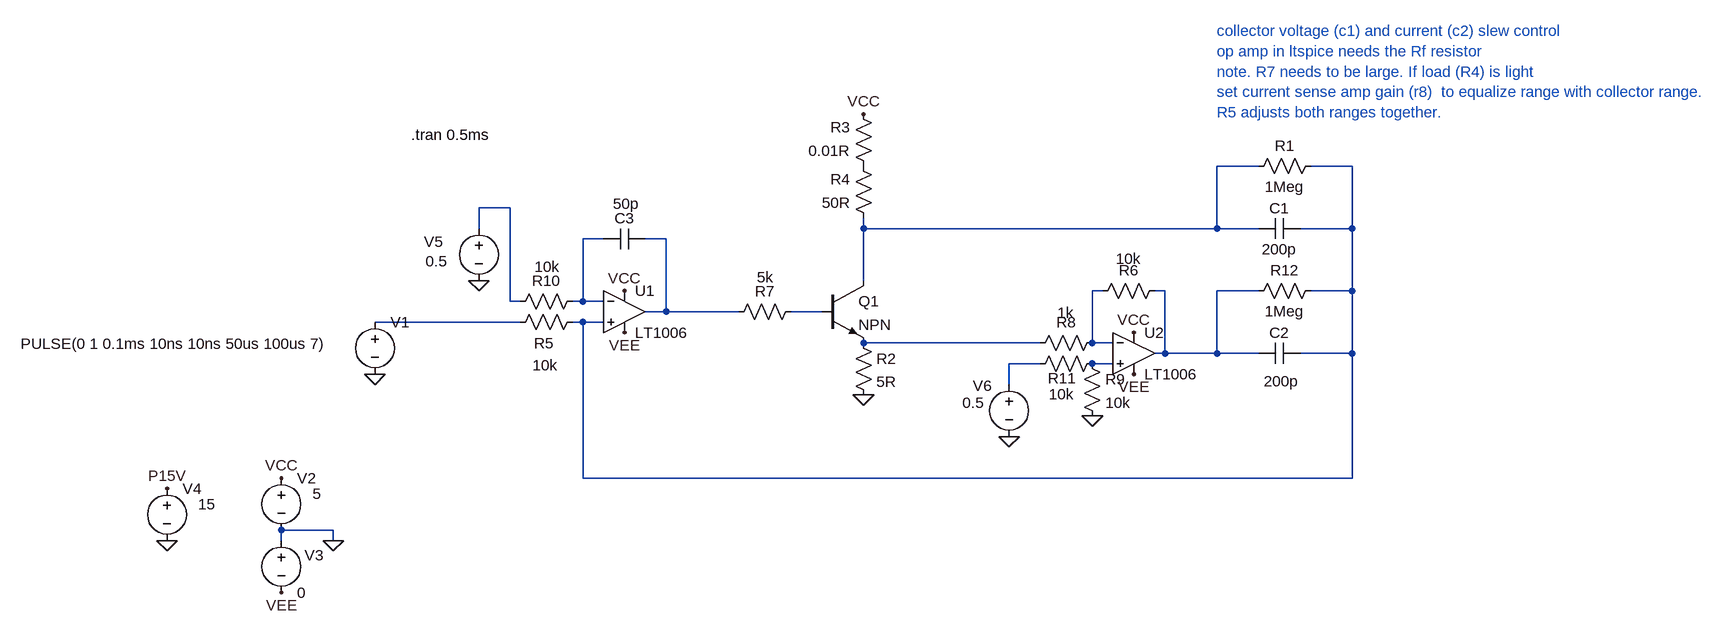
[diagram p0: schematic Draft65.asc]
Draft65.asc, the LTspice schematic file:
Version 4
SHEET 1 5720 1268
WIRE 1216 -176 1152 -176
WIRE 1360 -176 1296 -176
WIRE 64 -112 16 -112
WIRE 16 -80 16 -112
WIRE 608 -80 608 -96
WIRE 1152 -80 1152 -176
WIRE 1152 -80 608 -80
WIRE 1216 -80 1152 -80
WIRE 1360 -80 1360 -176
WIRE 1360 -80 1280 -80
WIRE 208 -64 176 -64
WIRE 304 -64 272 -64
WIRE 608 0 608 -80
WIRE 976 16 960 16
WIRE 1072 16 1056 16
WIRE 1216 16 1152 16
WIRE 1360 16 1360 -80
WIRE 1360 16 1296 16
WIRE 64 32 64 -112
WIRE 80 32 64 32
WIRE 176 32 176 -64
WIRE 176 32 160 32
WIRE 208 32 176 32
WIRE 304 48 304 -64
WIRE 304 48 272 48
WIRE 416 48 304 48
WIRE 544 48 496 48
WIRE 80 64 -144 64
WIRE 176 64 160 64
WIRE 208 64 176 64
WIRE 880 96 608 96
WIRE 960 96 960 16
WIRE 992 96 960 96
WIRE 1072 112 1072 16
WIRE 1072 112 1056 112
WIRE 1152 112 1152 16
WIRE 1152 112 1072 112
WIRE 1216 112 1152 112
WIRE 1360 112 1360 16
WIRE 1360 112 1280 112
WIRE 880 128 832 128
WIRE 992 128 960 128
WIRE 832 160 832 128
WIRE 176 304 176 64
WIRE 1360 304 1360 112
WIRE 1360 304 176 304
WIRE -208 384 -288 384
WIRE -288 400 -288 384
WIRE -208 400 -208 384
FLAG -208 400 0
FLAG -288 304 VCC
FLAG -288 480 VEE
FLAG -464 400 0
FLAG -464 320 P15V
FLAG 240 16 VCC
FLAG 1024 144 VEE
FLAG -144 144 0
FLAG 608 176 0
FLAG 16 0 0
FLAG 608 -256 VCC
FLAG 1024 80 VCC
FLAG 960 208 0
FLAG 832 240 0
FLAG 240 80 VEE
SYMBOL voltage -288 288 R0
WINDOW 123 0 0 Left 0
WINDOW 39 0 0 Left 0
WINDOW 3 48 40 Left 2
SYMATTR Value 5
SYMATTR InstName V2
SYMBOL voltage -288 384 R0
WINDOW 123 0 0 Left 0
WINDOW 39 0 0 Left 0
WINDOW 0 36 39 Left 2
SYMATTR InstName V3
SYMATTR Value 0
SYMBOL voltage -464 304 R0
WINDOW 123 0 0 Left 0
WINDOW 39 0 0 Left 0
WINDOW 3 48 40 Left 2
SYMATTR Value 15
SYMATTR InstName V4
SYMBOL res 64 48 R270
WINDOW 0 32 56 VTop 2
WINDOW 3 85 57 VBottom 2
SYMATTR InstName R10
SYMATTR Value 10k
SYMBOL cap 1280 -96 R90
WINDOW 0 0 32 VBottom 2
WINDOW 3 32 32 VTop 2
SYMATTR InstName C1
SYMATTR Value 200p
SYMBOL voltage -144 48 R0
WINDOW 123 0 0 Left 0
WINDOW 39 0 0 Left 0
WINDOW 3 -545 49 Left 2
SYMATTR Value PULSE(0 1 0.1ms 10ns 10ns 50us 100us 7)
SYMATTR InstName V1
SYMBOL res 1312 -192 R90
WINDOW 0 0 56 VBottom 2
WINDOW 3 32 56 VTop 2
SYMATTR InstName R1
SYMATTR Value 1Meg
SYMBOL npn 544 0 R0
SYMATTR InstName Q1
SYMBOL res 592 80 R0
SYMATTR InstName R2
SYMATTR Value 5R
SYMBOL res 624 -160 R180
WINDOW 0 36 76 Left 2
WINDOW 3 36 40 Left 2
SYMATTR InstName R3
SYMATTR Value 0.01R
SYMBOL res 624 -80 R180
WINDOW 0 36 76 Left 2
WINDOW 3 36 40 Left 2
SYMATTR InstName R4
SYMATTR Value 50R
SYMBOL voltage 16 -96 R0
WINDOW 123 0 0 Left 0
WINDOW 39 0 0 Left 0
WINDOW 3 -82 66 Left 2
WINDOW 0 -84 36 Left 2
SYMATTR Value 0.5
SYMATTR InstName V5
SYMBOL res 400 64 R270
WINDOW 0 32 56 VTop 2
WINDOW 3 85 57 VBottom 2
SYMATTR InstName R7
SYMATTR Value 5k
SYMBOL OpAmps\\LT1006 240 -16 R0
SYMATTR InstName U1
SYMBOL res 176 48 R90
WINDOW 0 64 60 VBottom 2
WINDOW 3 67 58 VTop 2
SYMATTR InstName R5
SYMATTR Value 10k
SYMBOL cap 1280 96 R90
WINDOW 0 0 32 VBottom 2
WINDOW 3 43 29 VTop 2
SYMATTR InstName C2
SYMATTR Value 200p
SYMBOL OpAmps\\LT1006 1024 48 R0
SYMATTR InstName U2
SYMBOL res 1072 0 R90
WINDOW 0 0 56 VBottom 2
WINDOW 3 -49 56 VTop 2
SYMATTR InstName R6
SYMATTR Value 10k
SYMBOL res 864 112 R270
WINDOW 0 32 56 VTop 2
WINDOW 3 78 55 VBottom 2
SYMATTR InstName R8
SYMATTR Value 1k
SYMBOL res 944 112 R0
SYMATTR InstName R9
SYMATTR Value 10k
SYMBOL res 864 144 R270
WINDOW 0 -22 50 VTop 2
WINDOW 3 -15 49 VBottom 2
SYMATTR InstName R11
SYMATTR Value 10k
SYMBOL voltage 832 144 R0
WINDOW 123 0 0 Left 0
WINDOW 39 0 0 Left 0
WINDOW 3 -72 44 Left 2
WINDOW 0 -56 18 Left 2
SYMATTR Value 0.5
SYMATTR InstName V6
SYMBOL cap 272 -80 R90
WINDOW 0 0 32 VBottom 2
WINDOW 3 -54 29 VTop 2
SYMATTR InstName C3
SYMATTR Value 50p
SYMBOL res 1312 0 R90
WINDOW 0 0 56 VBottom 2
WINDOW 3 32 56 VTop 2
SYMATTR InstName R12
SYMATTR Value 1Meg
TEXT -88 -224 Left 2 !.tran 0.5ms
TEXT 1152 -384 Left 2 ;collector voltage (c1) and current (c2) slew control\nop amp in ltspice needs the Rf resistor\nnote. R7 needs to be large. If load (R4) is light\nset current sense amp gain (r8)  to equalize range with collector range.\nR5 adjusts both ranges together.

The netlist it stands for:
* Draft65.asc
V2 VCC 0 5
V3 0 VEE 0
V4 P15V 0 15
R10 N003 N004 10k
C1 N002 N001 200p
V1 N009 0 PULSE(0 1 0.1ms 10ns 10ns 50us 100us 7)
R1 N002 N001 1Meg
Q1 N001 N008 N010 0 NPN
R2 N010 0 5R
R3 P001 VCC 0.01R
R4 N001 P001 50R
V5 N003 0 0.5
R7 N005 N008 5k
XU1 N002 N004 VCC VEE N005 LT1006  ; pins In+ In- V+ V- OUT
R5 N002 N009 10k
C2 N002 N007 200p
XU2 N012 N006 VCC VEE N007 LT1006  ; pins In+ In- V+ V- OUT
R6 N007 N006 10k
R8 N010 N006 1k
R9 N012 0 10k
R11 N011 N012 10k
V6 N011 0 0.5
C3 N005 N004 50p
R12 N002 N007 1Meg
.model NPN NPN
.model PNP PNP
.lib standard.bjt
.tran 0.5ms
* collector voltage (c1) and current (c2) slew control
* op amp in ltspice needs the Rf resistor
* note. R7 needs to be large. If load (R4) is light
* set current sense amp gain (r8)  to equalize range with collector range.
* R5 adjusts both ranges together.
.lib LTC.lib
.backanno
.end